# Altium schematic sheet 03-指示灯.SchDoc
size A4; DocumentNumber: 23; SheetNumber: 23; SheetTotal: 34
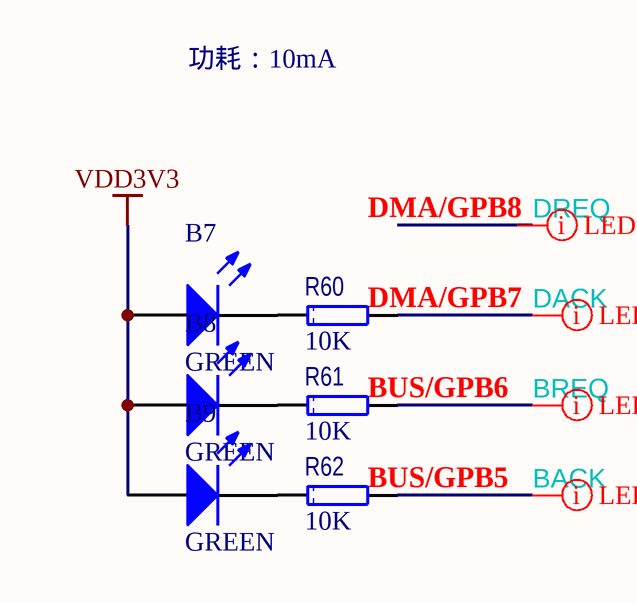
[diagram p0: 03-指示灯.SchDoc]

## Parts
B7  GREEN  [0805LED]
B8  GREEN  [0805LED]
B9  GREEN  [0805LED]
R60  value 10K  [1608[0603]R]  (hidden comment: CRCW060310K0FKEA)
R61  value 10K  [1608[0603]R]  (hidden comment: CRCW060310K0FKEA)
R62  value 10K  [1608[0603]R]  (hidden comment: CRCW060310K0FKEA)

## Nets
VDD3V3: B7.1(A) B8.1(A) B9.1(A)
BACK: R62.2
BREQ: R61.2
DACK: R60.2
NetB7_2: B7.2(K) R60.1
NetB8_2: B8.2(K) R61.1
NetB9_2: B9.2(K) R62.1

## Layout directives
net class LED: BACK, BREQ, DACK, DREQ

## Notes on the sheet
- 功耗：10mA
- (near R60) DMA/GPB7
- (near R60) DMA/GPB8
- (near R62) BUS/GPB5
- (near R61) BUS/GPB6

## Library data of the parts
B7-B9 = LED2: Typical RED, GREEN, YELLOW, AMBER GaAs LED; Published: 8-Jun-2000; LatestRevisionDate: 17-Jul-2002; LatestRevisionNote: Re-released for DXP Platform.; PackageVersion: Feb-2002; PackageReference: 3.2X1.6X1.1; Publisher: Altium Limited; PackageDescription: SM LED; 2 Flat Leads
R60-R62 = RES: 厚膜电阻器 - SMD 1/10watt 10Kohms 1%; Manufacturer: Vishay / Dale; 尺寸: 0.85 mm W x 1.55 mm L x 0.45 mm H; 工作温度范围: - 55 C to + 155 C; 封装 / 箱体: 0603 (1608 metric); 封装: Reel; 功率额定值: 100 mW; 产品: Thick Film Resistors SMD; 系列: CRCW; 温度系数: 100 PPM / K; 端接类型: SMD/SMT; 电压额定值: 75 V; 制造商: Vishay; 产品种类: 0603 Thick Film Chip Resistors; 标准包装数量: 5000; 外壳代码 - in: 0603; 外壳代码 - mm: 1608; Supplier 1: Mouser; Supplier Part Number 1: 71-CRCW0603-10K-E3; Manufacturer Part Number: CRCW060310K0FKEA; RoHS: RoHS Compliant By Exemption; Category: 厚膜电阻器 - SMD; Stock 1: 0; Pricing 1: 1=0.080, 10=0.013, 100=0.010, 1000=0.008, 5000=0.005, 25000=0.004, 50000=0.003 (USD); 电阻: 10 kOhms; 容差: 1 %; RoHS - 贸泽: E; Minimum Order Quantity: 1; Reeling: True; ComponentLink1URL: http://www.mouser.com/ds/2/427/dcrcwe3-109170.pdf; ComponentLink1Description: http://www.mouser.com/ds/2/427/dcrcwe3-109170.pdf; Description 1: 厚膜电阻器 - SMD 1/10watt 10Kohms 1%